# Altium schematic sheet configure.SchDoc
size A4
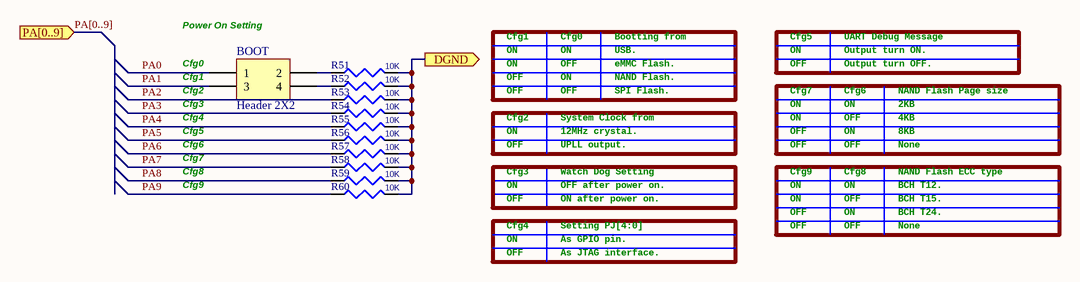
[diagram p0: configure.SchDoc]

## Parts
BOOT  Header 2X2  [HDR2X2]
R51  10K  [0603R]
R52  10K  [0603R]
R53  10K  [0603R]
R54  10K  [0603R]
R55  10K  [0603R]
R56  10K  [0603R]
R57  10K  [0603R]
R58  10K  [0603R]
R59  10K  [0603R]
R60  10K  [0603R]

## Ports
DGND (out), PA[0..9] (in)

## Nets
DGND: R51.2 R52.2 R53.2 R54.2 R55.2 R56.2 R57.2 R58.2 R59.2 R60.2 ; port DGND
PA0: BOOT.1
PA1: BOOT.3
PA2: R53.1
PA3: R54.1
PA4: R55.1
PA5: R56.1
PA6: R57.1
PA7: R58.1
PA8: R59.1
PA9: R60.1
NetBOOT_2: BOOT.2 R51.1
NetBOOT_4: BOOT.4 R52.1

## Buses and harness runs
bus PA[0..9] = port PA[0..9]

## Notes on the sheet
- (near BOOT) Power On Setting
- (near BOOT) Cfg0
- Cfg1
- ON
- Cfg0
- OFF
- USB.
- Bootting from
- eMMC Flash.
- Cfg5
- UART Debug Message
- Output turn ON.
- Output turn OFF.
- (near BOOT) Cfg1
- (near BOOT) Cfg2
- (near BOOT) Cfg3
- (near BOOT) Cfg4
- (near BOOT) Cfg5
- Cfg2
- 12MHz crystal.
- System Clock from
- SPI Flash.
- NAND Flash.
- Cfg7
- Cfg6
- 2KB
- NAND Flash Page size
- 4KB
- 8KB
- Cfg8
- Cfg9
- Cfg3
- UPLL output.
- OFF after power on.
- Watch Dog Setting
- ON after power on.
- None
- BCH T12.
- NAND Flash ECC type
- BCH T15.
- Cfg4
- As GPIO pin.
- Setting PJ[4:0]
- As JTAG interface.
- BCH T24.

## Library data of the parts
BOOT = Header 2X2: Header, 2-Pin, Dual row; LatestRevisionDate: 17-Jul-2002; LatestRevisionNote: Re-released for DXP Platform.; Publisher: Altium Limited
R51-R60 = R_Dup1